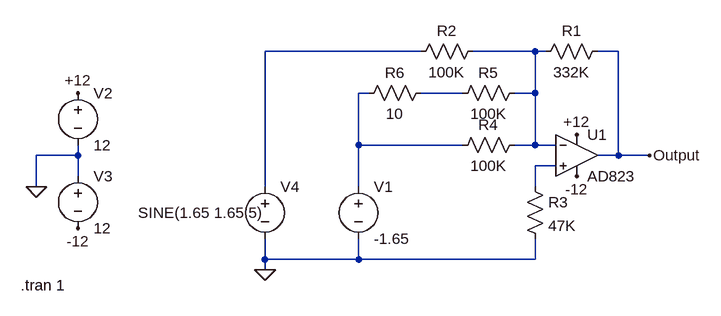
[diagram p0: schematic output3.asc]
output3.asc, the LTspice schematic file:
Version 4
SHEET 1 880 680
WIRE 32 16 -208 16
WIRE 208 16 112 16
WIRE 224 16 208 16
WIRE 336 16 304 16
WIRE -48 80 -64 80
WIRE 96 80 32 80
WIRE 208 80 208 16
WIRE 208 80 176 80
WIRE -64 160 -64 80
WIRE 96 160 -64 160
WIRE 208 160 208 80
WIRE 208 160 176 160
WIRE 240 160 208 160
WIRE -496 176 -496 160
WIRE -496 176 -560 176
WIRE 336 176 336 16
WIRE 336 176 304 176
WIRE 384 176 336 176
WIRE 240 192 208 192
WIRE -496 208 -496 176
WIRE -560 224 -560 176
WIRE -208 224 -208 16
WIRE -64 224 -64 160
WIRE 208 224 208 192
WIRE -208 336 -208 304
WIRE -64 336 -64 304
WIRE -64 336 -208 336
WIRE 208 336 208 304
WIRE 208 336 -64 336
WIRE -208 352 -208 336
FLAG -560 224 0
FLAG -496 288 -12
FLAG -496 80 +12
FLAG 272 144 +12
FLAG 272 208 -12
FLAG -208 352 0
FLAG 384 176 Output
SYMBOL OpAmps\\AD823 272 112 R0
SYMATTR InstName U1
SYMBOL voltage -64 208 R0
WINDOW 123 0 0 Left 0
WINDOW 39 0 0 Left 0
SYMATTR InstName V1
SYMATTR Value -1.65
SYMBOL voltage -496 64 R0
WINDOW 123 0 0 Left 0
WINDOW 39 0 0 Left 0
SYMATTR InstName V2
SYMATTR Value 12
SYMBOL voltage -496 192 R0
WINDOW 123 0 0 Left 0
WINDOW 39 0 0 Left 0
SYMATTR InstName V3
SYMATTR Value 12
SYMBOL voltage -208 208 R0
WINDOW 3 -195 56 Left 2
WINDOW 123 0 0 Left 0
WINDOW 39 0 0 Left 0
SYMATTR Value SINE(1.65 1.65 5)
SYMATTR InstName V4
SYMBOL res 320 0 R90
WINDOW 0 0 56 VBottom 2
WINDOW 3 32 56 VTop 2
SYMATTR InstName R1
SYMATTR Value 332K
SYMBOL res 128 0 R90
WINDOW 0 0 56 VBottom 2
WINDOW 3 32 56 VTop 2
SYMATTR InstName R2
SYMATTR Value 100K
SYMBOL res 192 208 R0
SYMATTR InstName R3
SYMATTR Value 47K
SYMBOL res 192 144 R90
WINDOW 0 0 56 VBottom 2
WINDOW 3 32 56 VTop 2
SYMATTR InstName R4
SYMATTR Value 100K
SYMBOL res 192 64 R90
WINDOW 0 0 56 VBottom 2
WINDOW 3 32 56 VTop 2
SYMATTR InstName R5
SYMATTR Value 100K
SYMBOL res 48 64 R90
WINDOW 0 0 56 VBottom 2
WINDOW 3 32 56 VTop 2
SYMATTR InstName R6
SYMATTR Value 10
TEXT -584 376 Left 2 !.tran 1

The netlist it stands for:
* output3.asc
XU1 N005 N002 +12 -12 Output AD823  ; pins In+ In- V+ V- OUT
V1 N003 0 -1.65
V2 +12 0 12
V3 0 -12 12
V4 N001 0 SINE(1.65 1.65 5)
R1 Output N002 332K
R2 N002 N001 100K
R3 N005 0 47K
R4 N002 N003 100K
R5 N002 N004 100K
R6 N004 N003 10
.tran 1
.lib ADI.lib
.backanno
.end